# EasyEDA Pro project CyberryPotter-6050-v4.0.eprj, board PCB_Main
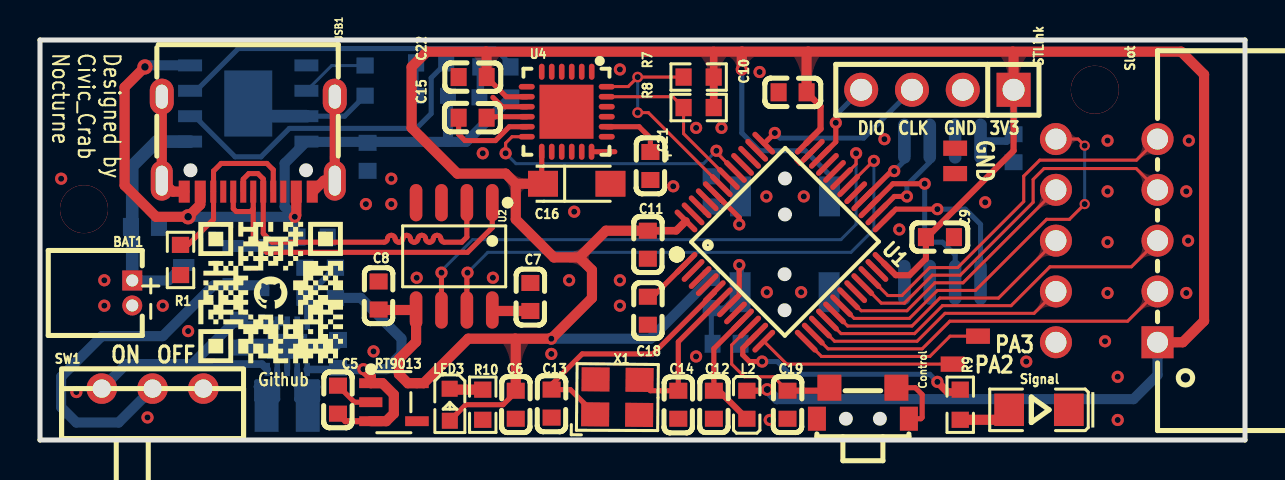
[diagram p4: board, top side]
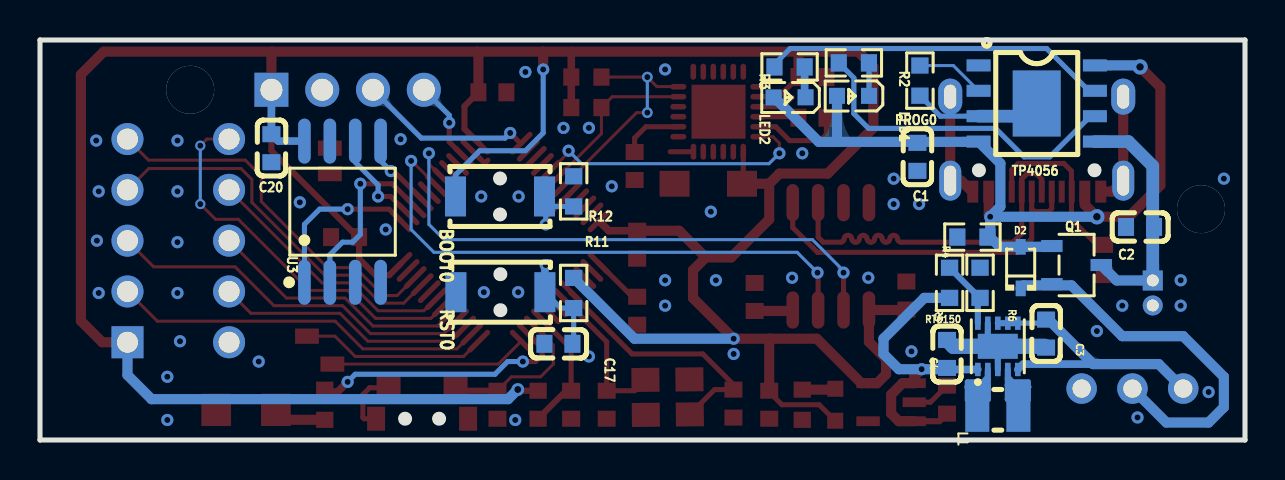
[diagram p5: board, bottom side, seen from below]

Outline 60.25 x 20 mm; copper layers: Top Layer, Bottom Layer. Coordinates in mm from the lower left corner of the outline.
Outline path: 0,20 0,0 60.25,0 60.25,20 0,20
Stack: Top Layer 0.035mm - / Dielectric1 1.51mm FR4 er 4.5 / Bottom Layer 0.035mm -

## Design rules (mm)
net D+: DP1
net D-: DP1
template: 自定义配置
spacing copperThickness1oz (default): track to track 0.102, other pairs 0.152 to 0.3
spacing copperThickness2oz: track to track 0.203, other pairs 0.152 to 0.3
track width copperThickness1oz (default): min 0.127, default 0.254, max 2.54
track width copperThickness2oz: min 0.203, default 0.254, max 2.54
differential pair differentialPair (default): width min 0.127, default 0.254, max 2.54; gap min 0.152, default 0.152
via viaSize (default): diameter min 0.5, default 0.61, max 10; hole min 0.3, default 0.305, max 6.299
net $1N21597 uses RT1650

## Placement (name value [footprint] x y rotation side)
BAT1  HC-1.25-2AW  [CONN-TH_2P-P1.25_HCTL_HC-1.25-2AW]  4.61 7.35 270 top
BOOT0  ZX-QC34-2TPDZ  [KEY-SMD_L3.9-W3.0-LS5.0-EH]  37.25 12.18 0 bottom
C1  10uF 0603  [C0603]  16.38 14.16 270 bottom
C2  10uF 0603  [C0603]  5.25 10.65 0 bottom
C3  10uF 0603  [C0603]  9.95 5.32 270 bottom
C4  22uF 0603  [C0603]  14.9 4.3 90 bottom
C5  1uF 0603  [C0603]  14.9 2.02 90 top
C6  1uF 0603  [C0603]  23.79 1.76 270 top
C7  0.1uF 0603  [C0603]  24.52 7.15 90 top
C8  0.1uF 0603  [C0603]  16.93 7.22 90 top
C9  0.1uF 0603  [C0603]  45 10.15 0 top
C10  0.1uF 0603  [C0603]  37.63 17.38 180 top
C11  0.1uF 0603  [C0603]  30.39 9.76 270 top
C12  0.1uF 0603  [C0603]  33.7 1.76 270 top
C13  12pF  [C0603]  25.58 1.82 90 top
C14  12pF  [C0603]  31.92 1.76 90 top
C15  0.1uF 0603  [C0603]  21.63 16.11 0 top
C16  100nF 1206 Ta  [CAP-SMD_L3.2-W1.6-RD]  26.84 12.81 0 top
C17  0.1uF 0603  [C0603]  34.33 4.81 0 bottom
C18  0.1uF 0603  [C0603]  30.39 6.46 270 top
C19  0.1uF 0603  [C0603]  37.38 1.76 270 top
C20  0.1uF 0603  [C0603]  48.68 14.59 270 bottom
C21  2.2uF  [C0603]  30.52 13.7 270 top
C22  10nF  [C0603]  21.63 18.15 180 top
Control  TS24CA  [SW-SMD_TS24CA]  41.15 1.84 180 top
D2  B5817WS  [SOD-323_L1.7-W1.3-LS2.5-FD]  11.22 8.62 270 bottom
L1  2.2uH 2.7A  [IND-SMD_L2.5-W2.0]  12.36 1.51 180 bottom
L2  CBG160808U000T  [L0603]  35.35 1.76 90 top
LED1  NCD0603G1  [LED0603-RD]  19.6 17.21 0 bottom
LED2  NCD0603R1  [LED0603-RD_RED]  22.77 17.13 0 bottom
LED3  NCD0603R1  [LED0603-RD_RED]  20.49 1.76 270 top
NOREF  -  [Pad_e443]  46.9 5.19 0 top
NOREF#2  -  [Pad_e433]  45.63 3.8 0 top
NOREF#3  -  [Pad_e255]  45.76 13.32 0 top
NOREF#4  -  [Pad_e254]  45.76 14.59 0 top
PROG0  4.7kΩ 0603  [R0603]  16.26 17.97 90 bottom
Q1  CJ3401  [SOT-23-3_L2.9-W1.6-P1.90-LS2.8-BR]  8.42 8.75 0 bottom
R1  5.1kΩ 0603  [R0603]  7.03 9 90 top
R2  4.7kΩ 0603  [R0603]  19.56 18.86 180 bottom
R3  4.7kΩ 0603  [R0603]  22.77 18.65 180 bottom
R4  10kΩ 0603  [R0603]  13.63 10.15 0 bottom
R5  487kΩ 0603  [R0603]  14.77 7.86 270 bottom
R6  86.6kΩ 0603  [R0603]  13.25 7.86 270 bottom
R7  4.7kΩ 0603  [R0603]  32.93 18.15 180 top
R8  4.7kΩ 0603  [R0603]  32.93 16.62 180 top
R9  470Ω 0603  [R0603]  46.02 1.76 270 top
R10  4.7kΩ 0603  [R0603]  22.14 1.76 270 top
R11  10kΩ 0603  [R0603]  33.57 7.35 270 bottom
R12  10kΩ 0603  [R0603]  33.57 12.43 270 bottom
RST0  ZX-QC34-2TPDZ  [KEY-SMD_L3.9-W3.0-LS5.0-EH]  37.23 7.39 0 bottom
RT6150  RT6150BGQW  [WSON-10_L2.5-W2.5-P0.50-BL-EP]  12.36 4.68 180 bottom
RT9013  RT9013-33GB  [SOT-23-5_L3.0-W1.7-P0.95-LS2.8-BL]  17.69 1.89 270 top
Signal  NCD1206R1  [LED1206-R-RD_RED]  49.95 1.51 180 top
Slot  ER10BGFBK  [CONN-TH_10P-P2.54_WINGTAT_ER10BGFBK]  53.34 9.97 90 top
STLink  PZ254V-11-04P  [HDR-TH_4P-P2.54-V-M]  44.87 17.51 180 top
SW1  TA-3522-A3  [SW-TH_3P-L9.1-W3.5-P2.50-A3]  5.63 2.57 0 top
TP4056  TP4056-42-ESOP8  [ESOP-8_L4.9-W3.9-P1.27-LS6.0-BL-EP]  10.41 16.83 270 bottom
U1  STM32F103CBT6  [LQFP-48_L7.0-W7.0-P0.50-LS9.0-BL]  37.25 9.89 315 top
U2  CH340N  [SOP-8_L4.9-W3.9-P1.27-LS6.0-BL]  20.71 9.18 180 top
U3  W25Q16JVSSIQ  [SOIC-8_L5.3-W5.3-P1.27-LS8.0-BL]  45.13 11.42 180 bottom
U4  MPU-6050  [QFN-24_L4.0-W4.0-P0.50-BL-EP2.7]  26.34 16.41 180 top
USB1  TYPE-C 16PIN 2MD(073)  [USB-C-SMD_TYPE-C-6PIN-2MD-073]  10.41 14.79 180 top
X1  8MHz 12pf  [OSC-SMD_4P-L3.2-W2.5-BL]  28.87 2.14 359.4 top

## Footprints (pads in the part's own frame, mm; a bottom-side part is the same pattern mirrored in y, then rotated)
C0603
  rect 0.8x0.9 smd: 1(-0.7,0) 2(0.7,0)
CAP-SMD_L3.2-W1.6-RD
  rect 1.5x1.296 smd: 1(-1.687,0) 2(1.687,0)
CONN-TH_2P-P1.25_HCTL_HC-1.25-2AW
  rect 1x1 hole 0.6: 1(-0.625,0)
  round 1 hole 0.6: 2(0.625,0)
CONN-TH_10P-P2.54_WINGTAT_ER10BGFBK
  rect 1.6x1.6 hole 1.05: 1(-5.08,-2.54)
  round 1.6 hole 1.05: 2(-5.08,2.54) 3(-2.54,-2.54) 4(-2.54,2.54) 5(0,-2.54) 6(0,2.54) 7(2.54,-2.54) 8(2.54,2.54) 9(5.08,-2.54) 10(5.08,2.54)
ESOP-8_L4.9-W3.9-P1.27-LS6.0-BL-EP
  rect 0.6x1.2 smd: 1(-1.905,-2.909) 2(-0.635,-2.909) 3(0.635,-2.909) 4(1.905,-2.909) 5(1.905,2.909) 6(0.635,2.909) 7(-0.635,2.909) 8(-1.905,2.909)
  rect 3.3x2.4 smd: 9(0,0)
HDR-TH_4P-P2.54-V-M
  rect 1.7x1.7 hole 1.1: 1(-3.81,0)
  round 1.7 hole 1.1: 2(-1.27,0) 3(1.27,0) 4(3.81,0)
IND-SMD_L2.5-W2.0
  rect 1.2x2.2 smd: 1(1.028,0) 2(-1.028,0)
KEY-SMD_L3.9-W3.0-LS5.0-EH
  rect 1.05x2 smd: 1(-2.225,0) 2(2.225,0)
L0603
  rect 0.8x0.864 smd: 1(-0.7,0) 2(0.7,0)
LED0603-RD
  rect 0.8x0.8 smd: 1(-0.799,0) 2(0.799,0)
LED0603-RD_RED
  rect 0.8x0.8 smd: 1(-0.799,-0.004) 2(0.799,0.004)
LED1206-R-RD_RED
  rect 1.485x1.62 smd: 1(1.492,0) 2(-1.492,0)
LQFP-48_L7.0-W7.0-P0.50-LS9.0-BL
  oval 0.27x1.5 smd: 1(-2.75,-4.25) 2(-2.25,-4.25) 3(-1.75,-4.25) 4(-1.25,-4.25) 5(-0.75,-4.25) 6(-0.25,-4.25) 7(0.25,-4.25) 8(0.75,-4.25) 9(1.25,-4.25) 10(1.75,-4.25) 11(2.25,-4.25) 12(2.75,-4.25) 25(2.75,4.25) 26(2.25,4.25) 27(1.75,4.25) 28(1.25,4.25) 29(0.75,4.25) 30(0.25,4.25) 31(-0.25,4.25) 32(-0.75,4.25) 33(-1.25,4.25) 34(-1.75,4.25) 35(-2.25,4.25) 36(-2.75,4.25)
  oval 1.5x0.27 smd: 13(4.25,-2.75) 14(4.25,-2.25) 15(4.25,-1.75) 16(4.25,-1.25) 17(4.25,-0.75) 18(4.25,-0.25) 19(4.25,0.25) 20(4.25,0.75) 21(4.25,1.25) 22(4.25,1.75) 23(4.25,2.25) 24(4.25,2.75) 37(-4.25,2.75) 38(-4.25,2.25) 39(-4.25,1.75) 40(-4.25,1.25) 41(-4.25,0.75) 42(-4.25,0.25) 43(-4.25,-0.25) 44(-4.25,-0.75) 45(-4.25,-1.25) 46(-4.25,-1.75) 47(-4.25,-2.25) 48(-4.25,-2.75)
OSC-SMD_4P-L3.2-W2.5-BL
  rect 1.4x1.2 smd: 1(-1.1,-0.875) 2(1.1,-0.875) 3(1.1,0.875) 4(-1.1,0.875)
Pad_e254
  custom 1.193x0.766 smd: 49(0,0)
Pad_e255
  custom 1.193x0.766 smd: 49(0,0)
Pad_e433
  custom 1.193x0.766 smd: 49(0,0)
Pad_e443
  custom 1.193x0.766 smd: 49(0,0)
QFN-24_L4.0-W4.0-P0.50-BL-EP2.7
  oval 0.28x0.8 smd: 1(-1.25,-2) 2(-0.75,-2) 3(-0.25,-2) 4(0.25,-2) 5(0.75,-2) 6(1.25,-2) 13(1.25,2) 14(0.75,2) 15(0.25,2) 16(-0.25,2) 17(-0.75,2) 18(-1.242,2)
  oval 0.8x0.28 smd: 7(2,-1.25) 8(2,-0.75) 9(2,-0.25) 10(2,0.25) 11(2,0.75) 12(2,1.25) 19(-2,1.25) 20(-2,0.75) 21(-2,0.25) 22(-2,-0.25) 23(-2,-0.75) 24(-2,-1.25)
  rect 2.7x2.7 smd: 25(0.013,0)
R0603
  rect 0.806x0.864 smd: 1(-0.753,0) 2(0.753,0)
SOD-323_L1.7-W1.3-LS2.5-FD
  rect 0.78x0.5 smd: 1(-1.04,0) 2(1.04,0)
SOIC-8_L5.3-W5.3-P1.27-LS8.0-BL
  oval 0.63x2.25 smd: 1(-1.905,-3.53) 2(-0.635,-3.53) 3(0.635,-3.53) 4(1.905,-3.53) 5(1.905,3.53) 6(0.635,3.53) 7(-0.635,3.53) 8(-1.905,3.53)
SOP-8_L4.9-W3.9-P1.27-LS6.0-BL
  oval 0.63x1.865 smd: 1(-1.905,-2.683) 2(-0.635,-2.683) 3(0.635,-2.683) 4(1.905,-2.683) 5(1.905,2.683) 6(0.635,2.683) 7(-0.635,2.683) 8(-1.905,2.683)
SOT-23-3_L2.9-W1.6-P1.90-LS2.8-BR
  rect 1.07x0.6 smd: 1(1.235,-0.95) 2(1.235,0.95) 3(-1.235,0)
SOT-23-5_L3.0-W1.7-P0.95-LS2.8-BL
  rect 0.49x1.157 smd: 1(-0.95,-1.153) 2(0,-1.153) 3(0.95,-1.153)
  rect 0.49x1.175 smd: 4(0.95,1.153) 5(-0.95,1.153)
SW-SMD_TS24CA
  rect 0.9x1.2 smd: 1(-2.3,0.775) 2(2.3,0.775)
  rect 1.2x1.3 smd: 3(-1.675,-0.775) 4(1.675,-0.775)
SW-TH_3P-L9.1-W3.5-P2.50-A3
  round 1.524 hole 0.914: 1(-2.54,0) 2(0,0) 3(2.54,0)
USB-C-SMD_TYPE-C-6PIN-2MD-073
  rect 0.55x1.1 smd: 1(-3.2,2.375) 2(-2.4,2.375) 11(2.4,2.375) 12(3.2,2.375)
  rect 0.3x1.1 smd: 3(-1.75,2.375) 4(-1.25,2.375) 5(-0.75,2.375) 6(-0.25,2.375) 7(0.25,2.375) 8(0.75,2.375) 9(1.25,2.375) 10(1.75,2.375)
  oval 1.1x2 hole 0.6x1.5: 13(-4.325,1.825) 14(4.325,1.825)
  oval 1.2x1.8 hole 0.6x1.2: 13(-4.325,-2.375) 14(4.325,-2.375)
WSON-10_L2.5-W2.5-P0.50-BL-EP
  rect 0.28x0.665 smd: 1(-1,-1.157) 2(-0.5,-1.157) 3(0,-1.157) 4(0.5,-1.157) 5(1,-1.157) 6(1,1.157) 7(0.5,1.157) 8(0,1.157) 9(-0.5,1.157) 10(-1,1.157)
  rect 2x1.25 smd: 11(0,0)

## Nets
As in the schematic, except:
GND: BAT1.2 C1.2 C2.2 C3.2 C4.2 C5.2 C6.2 C7.2 C8.2 C9.2 C10.2 C11.2 C12.2 C13.1 C14.1 C15.1 C16.2 C17.2 C18.2 C19.2 C20.2 C21.2 C22.2 Control.1 Control.2 Control.3 NOREF#3.49 NOREF#4.49 PROG0.1 R1.1 R4.2 R6.1 R10.2 R12.1 RST0.2 RT6150.3 RT6150.9 RT6150.11 RT9013.2 Signal.2 Slot.2 STLink.2 TP4056.1 TP4056.3 TP4056.9 U1.8 U1.23 U1.35 U1.47 U2.3 U3.4 U4.1 U4.9 U4.11 U4.18 USB1.1 USB1.12 USB1.13 USB1.14 X1.2 X1.4
PA2: NOREF#2.49 U1.12
PA3: NOREF.49 U1.13

Pads without a net: RT9013 4; SW1 3; U1 2 3 4 20 29 32 33 38 39 40 45 46; U2 4; U3 3 7; U4 2 3 4 5 6 7 14 15 16 17 19 21 22 25; USB1 3 9

## Via types
v1: diameter 2.4, hole 2.4, Top Layer to Bottom Layer, 2 vias
v2: diameter 0.61, hole 0.305, Top Layer to Bottom Layer, 65 vias
v3: diameter 0.635, hole 0.355, Top Layer to Bottom Layer, 1 via
v4: diameter 0.762, hole 0.381, Top Layer to Bottom Layer, 2 vias
v5: diameter 0.533, hole 0.305, Top Layer to Bottom Layer, 2 vias
v6: diameter 0.508, hole 0.305, Top Layer to Bottom Layer, 2 vias

## Routing (per net, layer and track width the routed paths; a pad name or vN(x,y) marks a point on that pad's centre or on a via; arc(x,y) is an arc through that point)
3V3: length 178.5
  Top Layer w0.254: U4.13 25.09,13.1 25.19,13 ; C6.1 23.79,2.4 23.16,1.76 21.29,1.76 LED3.2 ; U4.8 23.31,17.16 C22.1
  Top Layer w0.305: v3(36.36,2.53) 36.3,2.46 L2.2 ; U1.36 39.03,15.56 39.03,16.69 C10.1 ; U1.24 42.79,8.24 43.48,8.24 44.3,9.06 44.3,10.08 48.68,14.46 STLink.1
  Top Layer w0.381: 30.39,10.46 31.81,10.46 32.3,10.95 ; 33.69,19.42 33.69,16.88 ; C10.1 38.39,17.45
  Top Layer w0.508: 48.64,19.42 48.68,19.38 STLink.1 ; 48.64,19.42 57.06,19.42 58.21,18.27 58.21,5.95 57.14,4.89 55.88,4.89 ; 48.64,19.42 38.41,19.42 ; C10.1 38.33,19.34 38.41,19.42 ; 23.79,12.81 25.19,12.81 25.19,13 ; 23.79,12.81 23.28,13.32 20.87,13.32 18.58,15.61 18.58,18.65 19.35,19.42 22.3,19.42 ; 23.79,12.81 23.79,11.03 25.7,9.13 26.96,9.13 ; 23.76,5.06 23.79,5.03 C6.1 ; 23.76,5.06 21.41,5.06 19.19,2.84 RT9013.5 18.39,2.84 17.95,3.29 17.95,4.05 18.8,4.91 U2.5 16.96,6.5 C8.1 ; 23.76,5.06 v2(25.57,5.06) 27.6,7.1 27.6,8.49 26.96,9.13 ; 35.1,19.42 22.3,19.42 ; 35.1,19.42 38.41,19.42 ; 35.1,19.42 35.09,19.41 v2(35.09,18.53) ; 26.96,9.13 28.3,10.46 30.39,10.46 ; 22.3,19.42 22.33,19.39 C22.1
  Bottom Layer w0.254: v2(35.09,18.53) 35.09,15.35 35.98,14.46 38.27,14.46 39.48,13.25 BOOT0.2
  Bottom Layer w0.381: STLink.1 C20.1 48.34,14.95 U3.8
  Bottom Layer w0.508: 56,4.63 55.88,4.63 55.88,3.25 54.68,2.04 36.85,2.04 v3(36.36,2.53) ; R11.1 30.53,5.06 v2(25.57,5.06)
GND: length 39.3
  Top Layer w0.254: U4.9 23.11,16.66 22.65,17.13 ; C15.1 20.93,15.29 21.25,14.97 22.77,14.97 23.47,15.66 U4.11 ; 38.67,14.49 38.01,13.84 37.86,13.99 ; C5.2 15.73,1.89 RT9013.2 ; Control.1 44.05,1.06 44.11,1.13 44.11,2.27 43.77,2.61 Control.3 ; USB1.1 13.63,12.4 ; U4.18 28.74,14.41
  Top Layer w0.508: USB1.12 6.64,12.42 USB1.14 USB1.14 ; USB1.13 USB1.13 14.2,12.97 13.63,12.4
  Bottom Layer w0.254: PROG0.1 15.23,16.19 TP4056.3
  Bottom Layer w0.305: RT6150.9 12.86,5.18 RT6150.11 RT6150.3
  Bottom Layer w0.635: TP4056.9 11.05,16.19 TP4056.3
  Bottom Layer w0.762: 10.01,4.68 RT6150.11 14.58,4.68 C4.2
  vias: v2(1.06,13.07) v2(1.82,2.4) v2(3.22,7.99) v2(3.22,6.72) v2(5.38,1.13) v2(6.14,6.72) v2(7.41,5.45) v2(16.3,11.8) v2(16.68,4.43) v2(17.57,13.07) v2(17.57,11.8) v2(18.84,8.11) v2(22.14,14.34) v2(22.65,8.11) v2(25.57,4.3) v2(26.46,7.99) v2(26.71,11.42) v2(29,18.53) v2(29,7.99) v2(29,6.72) v2(31.66,12.69) v2(32.81,15.61) v2(32.81,4.18) v2(34.08,15.61) v2(35.98,18.4) v2(36.32,12.18) v2(36.34,7.39) v2(36.49,1) v2(38.06,7.39) v2(38.19,12.18) v2(42.22,15.04) v2(42.97,10.53) v2(47.26,11.89) v2(49.32,3.92) v2(53.25,4.94) v2(53.38,14.97) v2(53.38,12.43) v2(53.38,9.89) v2(53.38,7.35) v2(53.89,3.16) v2(53.89,1) v2(57.32,12.43) v2(57.32,7.35) v2(57.45,14.97) v2(57.41,9.97)
VBAT_E: length 2.5
  Top Layer w0.254: 30.39,7.29 30.76,7.29 32.3,8.83
VCC_USB: length 43.1
  Top Layer w0.508: USB1.11 8.01,11.77 v4(7.41,11.16) 5.8,11.16 4.23,12.73 4.23,17.64 v4(5.25,18.65) ; USB1.2 12.81,11.23 v2(12.74,11.16)
  Bottom Layer w0.508: 16.33,14.91 13.32,14.91 TP4056.4 12.23,13.83 12.23,11.67 v2(12.74,11.16) ; 16.33,14.91 C1.1 ; 16.33,14.91 20.42,14.91 ; v2(12.74,11.16) v4(7.41,11.16) ; v2(12.74,11.16) 12.74,10.28 12.81,10.21 ; v4(5.25,18.65) 5.32,18.73 TP4056.8 ; 9.66,9.7 9.7,9.66 D2.1 12.27,9.66 12.81,10.21 ; 20.42,14.91 20.4,14.92 20.4,17.2 ; 20.42,14.91 21.31,14.91 23.61,17.2 ; 12.81,10.21 R4.1
(no net):
  vias: v1(2.2,11.54) v1(52.75,17.51)
BOOT0: length 5.1
  Top Layer w0.254: v2(34.97,10.78) 34.97,11.12 33.72,12.37
  Bottom Layer w0.254: 34.97,12.12 BOOT0.1 ; 34.97,12.12 34.53,11.68 33.57,11.68 ; 34.97,12.12 v2(34.97,10.78)
D+: length 18.3
  Top Layer w0.254: USB1.8 9.66,11.57 9.81,11.42 10.53,11.42 10.66,11.56 ; 10.66,11.56 10.66,10.06 11.34,9.38 21.38,9.38 22.61,10.62 U2.1 ; 10.66,11.56 USB1.6
D-: length 18.3
  Top Layer w0.254: USB1.7 10.16,13.04 10.44,13.32 10.9,13.32 11.16,13.05 USB1.5 11.16,10.33 11.6,9.89 17.21,9.89 arc(17.33,9.94) 17.38,10.06 arc(17.43,10.18) 17.55,10.23 17.59,10.23 arc(17.71,10.18) 17.76,10.06 arc(17.81,9.94) 17.93,9.89 17.97,9.89 arc(18.09,9.94) 18.14,10.06 arc(18.19,10.18) 18.31,10.23 18.35,10.23 arc(18.47,10.18) 18.52,10.06 arc(18.57,9.94) 18.69,9.89 18.73,9.89 arc(18.85,9.94) 18.9,10.06 arc(18.95,10.18) 19.07,10.23 19.11,10.23 arc(19.23,10.18) 19.28,10.06 arc(19.33,9.94) 19.45,9.89 19.49,9.89 arc(19.61,9.94) 19.66,10.06 arc(19.71,10.18) 19.83,10.23 19.87,10.23 arc(19.99,10.18) 20.04,10.06 arc(20.09,9.94) 20.21,9.89 21.09,9.89 21.35,10.15 U2.2
NRST: length 7.2
  Top Layer w0.254: U1.7 34.97,7.25 v2(34.97,8.75)
  Bottom Layer w0.254: RST0.1 34.22,6.6 33.57,6.6 33.57,4.87 C17.1
  Bottom Layer w0.381: RST0.1 35.01,8.71 v2(34.97,8.75)
OSC_IN: length 13
  Top Layer w0.254: U1.5 33.72,7.37 30.65,4.3 27.11,4.3 25.58,2.77 C13.2 26.52,2.52 X1.1
OSC_OUT: length 7.7
  Top Layer w0.254: X1.3 30.52,2.46 C14.2 31.92,4.91 34.07,7.06
PA0: length 7.7
  Top Layer w0.152: U1.10 34.58,4.75 34.58,3.8 35.22,3.16 36.68,3.16 C19.1
  Top Layer w0.305: Control.4 39.32,2.46 C19.1
PA1_LED: length 13
  Top Layer w0.254: U1.11 35.14,4.6 35.14,4.26 35.47,3.92 v2(36.11,3.92)
  Top Layer w0.381: v2(44.87,2.91) 45.38,2.4 45.9,2.4 R9.1
  Bottom Layer w0.254: v2(36.11,3.92) 36.87,3.92 37.51,3.29 44.49,3.29 v2(44.87,2.91)
PA2: length 10
  Top Layer w0.152: 45.76,3.8 37.34,3.8 U1.12
PA3: length 9.3
  Top Layer w0.152: NOREF.49 45.51,5.19 44.49,4.18 39.08,4.18 U1.13
PA4_CSS: length 18.7
  Top Layer w0.152: 55.88,7.43 55.87,7.43 54.38,5.94 45.49,5.94 44.11,4.56 39.4,4.56 38.67,5.3
PA5_SCK: length 13.1
  Top Layer w0.152: U1.15 39.73,4.94 43.86,4.94 45.25,6.34 49.71,6.34 Slot.4
PA6_MISO: length 18.7
  Top Layer w0.152: 39.37,6 40.06,5.32 43.73,5.32 45.13,6.72 48.55,6.72 50.5,8.66 54.57,8.66 55.88,9.97
PA7_MOSI: length 13.1
  Top Layer w0.152: Slot.6 47.93,7.1 45,7.1 43.6,5.7 40.38,5.7 U1.17
PA13_DIO: length 4.2
  Top Layer w0.254: v2(39.79,15.86) 39.79,14.91 39.02,14.13
  Bottom Layer w0.254: STLink.4 39.79,16.24 v2(39.79,15.86)
PA14_CLK: length 8.7
  Top Layer w0.254: U1.37 36.23,14.84 v2(36.74,15.35)
  Bottom Layer w0.254: v2(36.74,15.35) 37,15.1 41.19,15.1 STLink.3
PB0_CUS: length 19.3
  Top Layer w0.152: v6(52.24,14.72) 51.91,15.05 Slot.10 ; U1.18 40.71,6.08 43.48,6.08 44.87,7.48 46.78,7.48 50.33,11.03 51.48,11.03 v6(52.24,11.8)
  Bottom Layer w0.152: v6(52.24,11.8) v6(52.24,14.72)
PB1_ADC: length 13.1
  Top Layer w0.152: U1.19 40.46,7.06 41.06,6.46 43.35,6.46 44.74,7.86 46.15,7.86 Slot.8
PB5_INT1: length 14.2
  Top Layer w0.152: v2(33.82,14.46) 33.82,14.38 U1.41 ; U4.12 23.6,15.16 23.28,14.84 v2(23.28,14.34)
  Bottom Layer w0.152: v2(23.28,14.34) 23.8,13.82 33.18,13.82 v2(33.82,14.46)
PB6_SCL: length 8.5
  Top Layer w0.152: U1.42 32.18,15.32 R8.2 31.64,17.16 U4.23
PB7_SDA: length 11.5
  Top Layer w0.152: v5(29.89,16.37) 30.42,16.37 34.07,12.72 ; 31.93,18.15 v5(29.89,18.15) 29.41,17.67 28.09,17.67
  Bottom Layer w0.152: v5(29.89,16.37) v5(29.89,18.15)
PB10_SCL_TX: length 19
  Top Layer w0.152: 55.88,12.51 54.81,13.57 50.21,13.57 49.66,13.03 49.66,11.89 46.02,8.24 44.62,8.24 43.22,6.84 42.07,6.84 41.14,7.77
PB11_SDA_RX: length 18.7
  Top Layer w0.152: 55.88,15.05 54.83,13.99 49.99,13.99 49.19,13.19 49.19,11.92 45.89,8.62 44.49,8.62 43.09,7.22 42.39,7.22 U1.22
RXD: length 28.3
  Top Layer w0.152: v2(41.7,13.95) 41.67,13.95 U1.30
  Top Layer w0.254: U2.7 21.35,8.37
  Bottom Layer w0.152: v2(41.7,13.95) 41.7,10.53 40.55,9.38 22.39,9.38 v2(21.38,8.37)
SPI2_CS: length 8.3
  Top Layer w0.254: U1.25 42.79,11.54 v2(44.87,11.54)
  Bottom Layer w0.254: U3.1 47.03,10.78 46.27,11.54 v2(44.87,11.54)
SPI2_MISO: length 9.1
  Top Layer w0.254: U1.27 42.65,12.81 v2(44.24,12.81)
  Bottom Layer w0.254: v2(44.24,12.81) 44.24,10.27 44.62,9.89 45.13,9.89 45.76,9.26 U3.2
SPI2_MOSI: length 3.9
  Top Layer w0.254: v2(42.71,13.45) 42.58,13.45 U1.28
  Bottom Layer w0.254: v2(42.71,13.45) 43.22,13.95 U3.5
SPI2_SCK: length 5.1
  Top Layer w0.254: U1.26 42.72,12.18 v2(43.35,12.18)
  Bottom Layer w0.254: v2(43.35,12.18) 43.35,12.75 44.49,13.89 U3.6
TXD: length 28.6
  Top Layer w0.152: v2(40.81,14.34) 40.81,13.8 U1.31
  Top Layer w0.254: v2(20.08,8.37) U2.6
  Bottom Layer w0.152: 20.11,8.49 21.63,10.02 40.05,10.02 40.81,10.78 v2(40.81,14.34)
$1N1926: length 6
  Bottom Layer w0.254: L1.2 13.88,2.01 13.88,2.91 13.11,2.91 12.95,3.07 12.86,3.07
  Bottom Layer w0.305: 12.86,2.68 12.86,2.04 L1.2 ; 12.86,2.68 RT6150.2 ; 12.86,2.68 12.89,2.65 13.88,2.65
$1N2095: length 3.5
  Bottom Layer w0.305: 13.36,7 13.25,7.11 ; 13.36,7 13.36,7.2 R5.1 ; 13.36,7 RT6150.10
$1N5022: length 1.9
  Top Layer w0.508: C7.1 22.66,6.45 U2.8
$1N9764: length 9
  Top Layer w0.254: 8.68,12.43 8.68,11.03 7.4,9.76 R1.2 ; 8.68,12.43 8.68,13.45 9.06,13.83 11.34,13.83 11.66,13.51 USB1.4 ; 8.68,12.43 USB1.10
$1N10379: length 1.5
  Bottom Layer w0.381: LED2.1 22.02,17.18 R3.2
$1N10382: length 1.6
  Bottom Layer w0.254: 18.8,17.21 18.8,18.85 R2.2
$1N10530: length 17.1
  Bottom Layer w0.254: 23.46,18.86 22.74,19.57 9.92,19.57 7.8,17.46 TP4056.7
$1N10534: length 16.6
  Bottom Layer w0.254: R2.1 19.56,18.1 19.56,16.32 18.82,15.58 12.47,15.58 11.05,14.16 9.76,14.16 7.73,16.19 TP4056.6
$1N10716: length 3.5
  Bottom Layer w0.152: TP4056.2 14.58,18.72 PROG0.2
$1N11756: length 12
  Bottom Layer w0.508: Q1.3 6.42,7.98 BAT1.1
  Bottom Layer w0.635: BAT1.1 4.61,13.7 5.83,14.92 TP4056.5
$1N13991: length 6.4
  Top Layer w0.254: C12.1 33.7,4.57 35.13,6
  Top Layer w0.305: C12.1 33.95,2.46 L2.1
$1N14717: length 2.7
  Top Layer w0.508: Signal.1 47.96,1.01 46.02,1.01
$1N14914: length 1.7
  Top Layer w0.508: R10.1 20.53,2.52 LED3.1
$1N21597: length 7
  Bottom Layer w0.254: 11.86,3.07 11.77,3.07 11.61,2.91 10.84,2.91 10.84,2.01 L1.1
  Bottom Layer w0.305: 11.86,2.74 11.86,2.04 L1.1 ; 11.86,2.74 11.78,2.66 10.84,2.66 10.92,2.74 11.86,2.74 ; 11.86,2.74 RT6150.4
$1N22177: length 19.4
  Bottom Layer w0.508: D2.2 11.07,7.73 8.68,7.73 6.14,5.19 3.09,5.19 1.06,3.16 1.06,1.64 1.82,0.87 3.93,0.87 SW1.2 ; 5.79,2.47 5.59,2.47
$1N22183: length 14.6
  Bottom Layer w0.254: RT6150.6 10.12,5.84 C3.1
  Bottom Layer w0.305: RT6150.8 RT6150.7 RT6150.6
  Bottom Layer w0.381: RT6150.5 11.09,3.8 7.6,3.8
  Bottom Layer w0.508: SW1.1 4.31,3.8 7.6,3.8 9.82,6.02 C3.1
$1N34559: length 2.1
  Top Layer w0.254: U4.10 22.54,16.16 22.33,16.37
$1N43151: length 3.1
  Top Layer w0.254: U4.20 29.96,15.66 30.52,15.1 C21.1
$1N53472: length 16.3
  Top Layer w0.305: C5.1 15.28,0.94 RT9013.3
  Top Layer w0.508: RT9013.3 17.31,0.94 17.69,1.32 17.69,2.27 17.13,2.84 RT9013.1 16.54,3.17 v2(16.17,3.54)
  Bottom Layer w0.381: C4.1 14.82,3.53 RT6150.1
  Bottom Layer w0.508: 14.77,7.11 16.03,7.11 18.08,5.06 18.08,4.3 17.31,3.54 v2(16.17,3.54) 14.96,3.54 C4.1

## Copper pours and planes (outline as drawn; the poured copper is in the pictures)
GND on Top Layer: -1.48,21.58 63.41,21.58 63.41,-2.17 -1.48,-2.17
GND on Bottom Layer: -4.15,21.45 61.64,21.45 61.64,-4.08 -4.15,-4.08

Small or netless copper shapes (teardrops, artwork), in the pictures only: 151 on Top Layer, 93 on Bottom Layer

## Text on the board
Top Silkscreen Layer: + | Github | DIO | CLK | GND | 3V3 | Designed by / Civic_Crab / Nocturne | ON | OFF | PA2 | PA3 | -
